# EAGLE design Tarocco-Lite (EAGLE 8.0.0)
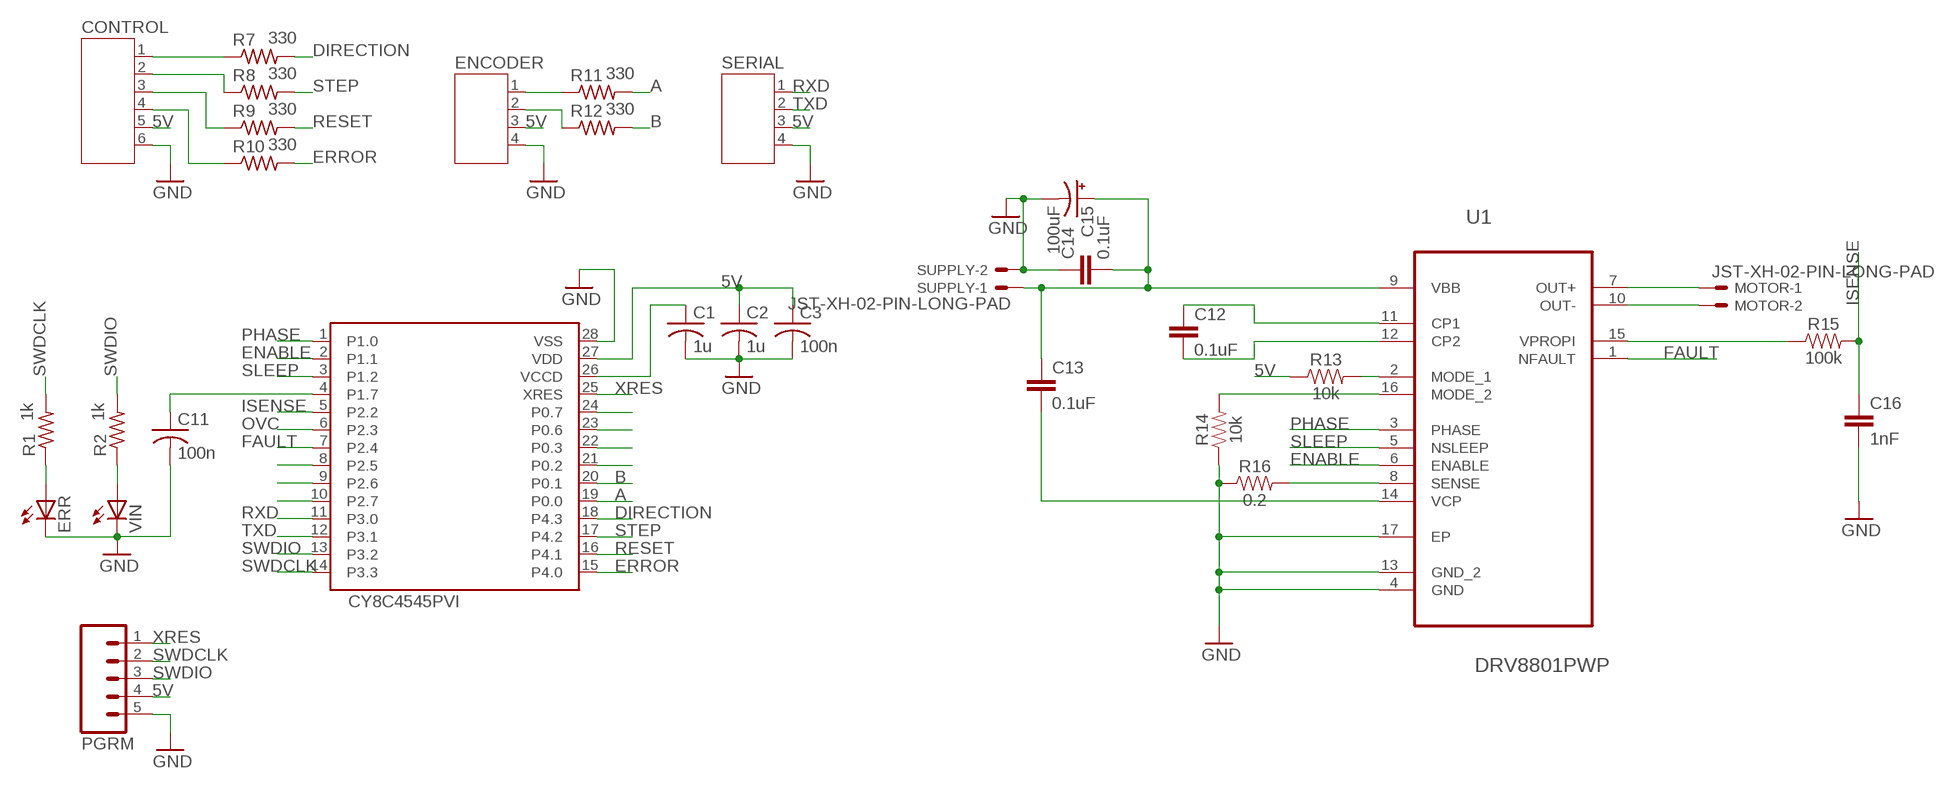
[diagram p0: schematic, sheet 1]

## Parts
C1  1u  C-USC0603  [C0603]
C2  1u  C-USC0603  [C0603]
C3  100n  C-USC0603  [C0603]
C11  100n  C-USC0603  [C0603]
C12  0.1uF  0.1UF-0603-100V-10%  [0603]
C13  0.1uF  0.1UF-0603-25V-(+80/-20%)  [0603]
C14  0.1uF  0.1UF-0603-25V-(+80/-20%)  [0603]
C15  100uF  100UF-POLAR-25V-20%(ELEC)  [PANASONIC_D]
C16  1nF  1.0NF/1000PF-0603-50V-10%  [0603]
CONTROL  JST-PH6  [JST-PH6]
ENCODER  JST-PH4  [JST-PH4]
ERR  LEDCHIP-LED0603  [CHIP-LED0603]
IC1  CY8C4545PVI  [SSOP28]
MOTOR  JST-XH-02-PIN-LONG-PAD  [JST-XH-02-PACKAGE-LONG-PAD]
PGRM  M05SMD2  [1X05-1MM-RA]
R1  1k  R-US_R0603  [R0603]
R2  1k  R-US_R0603  [R0603]
R7  330  R-US_R0603  [R0603]
R8  330  R-US_R0603  [R0603]
R9  330  R-US_R0603  [R0603]
R10  330  R-US_R0603  [R0603]
R11  330  R-US_R0603  [R0603]
R12  330  R-US_R0603  [R0603]
R13  10k  10KOHM-0603-1/10W-1%  [0603]
R14  10k  10KOHM-0603-1/10W-1%  [0603]
R15  100k  100KOHM-0603-1/10W-1%  [0603]
R16  0.2  0.1OHM-1210-1/2W-1%  [1210]
SERIAL  JST-PH4  [JST-PH4]
SUPPLY  JST-XH-02-PIN-LONG-PAD  [JST-XH-02-PACKAGE-LONG-PAD]
U1  DRV8801PWP  [SOP65P640X120-17N]
VIN  LEDCHIP-LED0603  [CHIP-LED0603]

## Nets
5V: C2.1 C3.1 CONTROL.5 ENCODER.3 IC1.27(VDD) PGRM.4 R13.1 SERIAL.3
A: IC1.19(P0.0) R11.2
B: IC1.20(P0.1) R12.2
DIRECTION: IC1.18(P4.3) R7.2
ENABLE: IC1.2(P1.1) U1.6(ENABLE)
ERROR: IC1.15(P4.0) R10.2
FAULT: IC1.7(P2.4) U1.1(NFAULT)
GND: C1.2 C2.2 C3.2 C11.2 C14.1 C15.- C16.2 CONTROL.6 ENCODER.4 ERR.C IC1.28(VSS) PGRM.5 R14.1 R16.1 SERIAL.4 SUPPLY.2 U1.4(GND) U1.13(GND_2) U1.17(EP) VIN.C
ISENSE: C16.1 IC1.5(P2.2) R15.2
N$8: ENCODER.1 R11.1
N$9: R13.2 U1.2(MODE_1)
N$10: ENCODER.2 R12.1
N$14: CONTROL.1 R7.1
N$18: CONTROL.2 R8.1
N$19: C1.1 IC1.26(VCCD)
N$20: CONTROL.3 R9.1
N$22: CONTROL.4 R10.1
N$24: ERR.A R1.1
N$25: R2.1 VIN.A
N$27: R15.1 U1.15(VPROPI)
N$28: C12.1 U1.11(CP1)
N$29: C11.1 IC1.4(P1.7)
N$30: C12.2 U1.12(CP2)
N$31: C13.2 U1.14(VCP)
N$32: R14.2 U1.16(MODE_2)
N$33: IC1.8(P2.5)
N$34: IC1.9(P2.6)
N$35: IC1.10(P2.7)
N$46: IC1.21(P0.2)
N$47: IC1.22(P0.3)
N$48: IC1.23(P0.6)
N$49: IC1.24(P0.7)
OVC: IC1.6(P2.3)
PHASE: IC1.1(P1.0) U1.3(PHASE)
RESET: IC1.16(P4.1) R9.2
RXD: IC1.11(P3.0) SERIAL.1
SENSE: R16.2 U1.8(SENSE)
SLEEP: IC1.3(P1.2) U1.5(NSLEEP)
STEP: IC1.17(P4.2) R8.2
SWDCLK: IC1.14(P3.3) PGRM.2 R1.2
SWDIO: IC1.13(P3.2) PGRM.3 R2.2
TXD: IC1.12(P3.1) SERIAL.2
VBB: C13.1 C14.2 C15.+ SUPPLY.1 U1.9(VBB)
VMOT+: MOTOR.1 U1.7(OUT+)
VMOT-: MOTOR.2 U1.10(OUT-)
XRES: IC1.25(XRES) PGRM.1

## Library data of the parts
C1-C3 C11 = adafruit:C-US: CAPACITOR, American symbol
C12 = SparkFun-Capacitors:0.1UF: 0.1µF ceramic capacitors A capacitor is a passive two-terminal electrical component used to store electrical energy temporarily in an electric field.; PROD_ID: CAP-08390
C13 C14 = SparkFun-Capacitors:0.1UF: 0.1µF ceramic capacitors A capacitor is a passive two-terminal electrical component used to store electrical energy temporarily in an electric field.; PROD_ID: CAP-00810
C15 = SparkFun-Capacitors:100UF-POLAR: 100µF polarized capacitors A capacitor is a passive two-terminal electrical component used to store electrical energy temporarily in an electric field.; PROD_ID: CAP-12547
C16 = SparkFun-Capacitors:1.0NF/1000PF: 1nF/1,000pF ceramic capacitors A capacitor is a passive two-terminal electrical component used to store electrical energy temporarily in an electric field.; PROD_ID: CAP-07886
CONTROL = jst-ph:JST-PH6
ENCODER SERIAL = jst-ph:JST-PH4
ERR VIN = adafruit:LED: LED OSRAM: - CHIPLED LG R971, LG N971, LY N971, LG Q971, LY Q971, LO R971, LY R971 LH N974, LH R974 LS Q976, LO Q976, LY Q976 LO Q996 - Hyper CHIPLED LW Q18S LB Q993, LB Q99A, LB R99A - SideLED LS A670, LO A670, LY A670, LG A670, LP A670 LB A673, LV A673, LT A673, LW A673 LH A674 LY A675 LS A676, LA A676, LO A676, LY A676, LW A676 LS A679, LY A679, LG A679 - Hyper Micro SIDELED® LS Y876, LA Y876, LO Y876, LY Y876 LT Y87S - SmartLED LW L88C, LW L88S LB L89C, LB L89S, LG L890 LS L89K, LO L89K, LY L89K LS L896, LA L896, LO L896, LY L896 - TOPLED LS T670, LO T670, LY T670, LG T670, LP T670 LSG T670, LSP T670, LSY T670, LOP T670, LYG T670 LG T671, LOG T671, LSG T671 LB T673, LV T673, LT T673, LW T673 LH T674 LS T676, LA T676, LO T676, LY T676, LB T676, LH T676, LSB T676, LW T676 LB T67C, LV T67C, LT T67C, LS T67K, LO T67K, LY T67K, LW E67C LS E67B, LA E67B, LO E67B, LY E67B, LB E67C, LV E67C, LT E67C LW T67C LS T679, LY T679, LG T679 LS T770, LO T770, LY T770, LG T770, LP T770 LB T773, LV T773, LT T773, LW T773 LH T774 LS E675, LA E675, LY E675, LS T675 LS T776, LA T776, LO T776, LY T776, LB T776 LHGB T686 LT T68C, LB T68C - Hyper Mini TOPLED® LB M676 - Mini TOPLED Santana® LG M470 LS M47K, LO M47K, LY M47K Source: http://www.osram.convergy.de/
IC1 = CY8C4200:CY8C4545PVI: CY8C4245 SSOP-28
MOTOR SUPPLY = JST XH Connectors v1-0:JST-XH-02-PIN: JST XH Connector 2 Pin Wire to board connector. Pitch: 2,54 mm, (0.100") Number of pins: 2 Created by Rembrandt Electronics www.rembrandtelectronics.com
PGRM = SparkFun-Connectors:M05: Header 5 Standard 5-pin 0.1" header. Use with straight break away headers (SKU : PRT-00116), right angle break away headers (PRT-00553), swiss pins (PRT-00743), machine pins (PRT-00117), and female headers (PRT-00115). Molex polarized connector foot print use with SKU : PRT-08230 with associated crimp pins and housings.
R1 R2 R7-R12 = adafruit:R-US_: RESISTOR, American symbol
R13 R14 = SparkFun-Resistors:10KOHM: 10kΩ resistor A resistor is a passive two-terminal electrical component that implements electrical resistance as a circuit element. Resistors act to reduce current flow, and, at the same time, act to lower voltage levels within circuits. - Wikipedia; PROD_ID: RES-00824
R15 = SparkFun-Resistors:100KOHM: 100kΩ resistor A resistor is a passive two-terminal electrical component that implements electrical resistance as a circuit element. Resistors act to reduce current flow, and, at the same time, act to lower voltage levels within circuits. - Wikipedia; PROD_ID: RES-07828
R16 = SparkFun-Resistors:0.1OHM: 0.1Ω resistor A resistor is a passive two-terminal electrical component that implements electrical resistance as a circuit element. Resistors act to reduce current flow, and, at the same time, act to lower voltage levels within circuits. - Wikipedia; PROD_ID: RES-12374; VALUE: 0.1
U1 = DRV8801PWP:DRV8801PWP: DMOS FULL-BRIDGE MOTOR DRIVERS; AVAILABILITY: Good; DESCRIPTION: 2.8A Brushed DC Motor Driver with Current Sense (PH/EN Ctrl) 16-HTSSOP -40 to 85; MF: Texas Instruments; MP: DRV8801PWP; PACKAGE: HTSSOP-16 Texas Instruments; PRICE: 2.38 USD

## Board
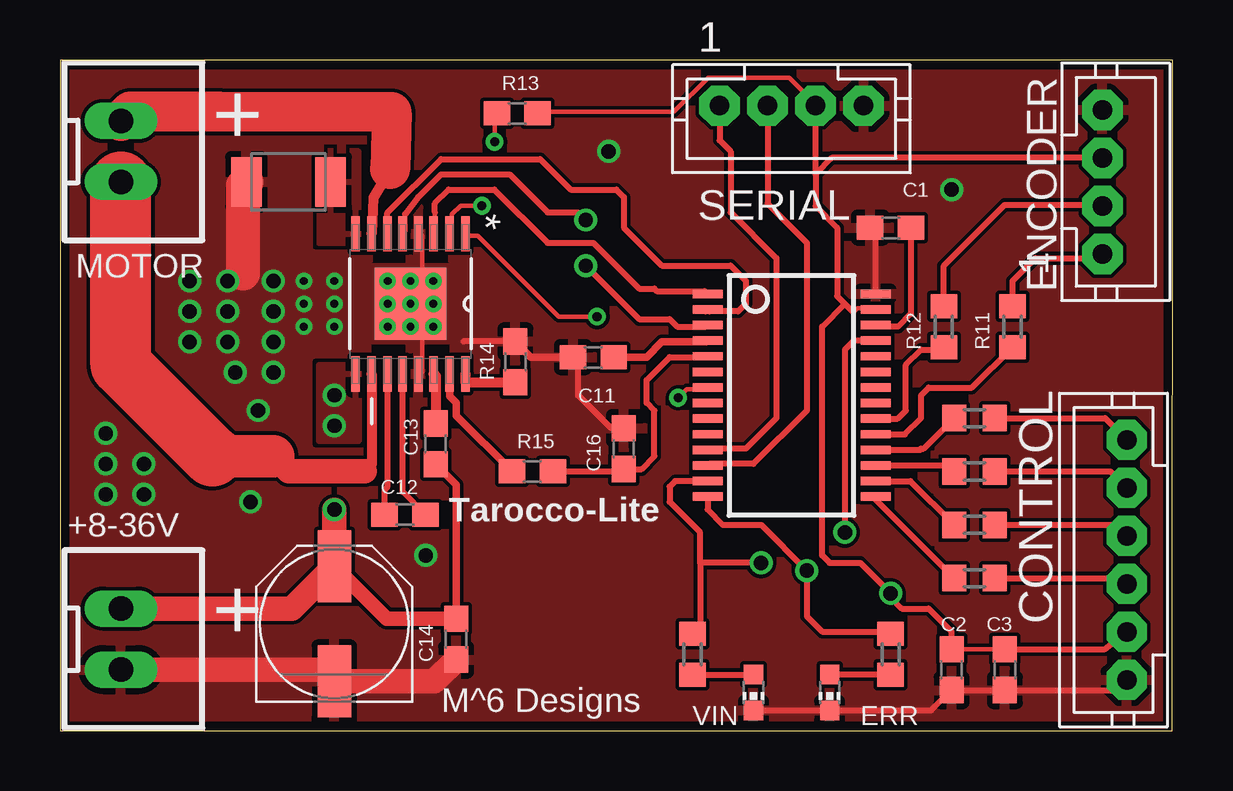
[diagram p1: board, top side]
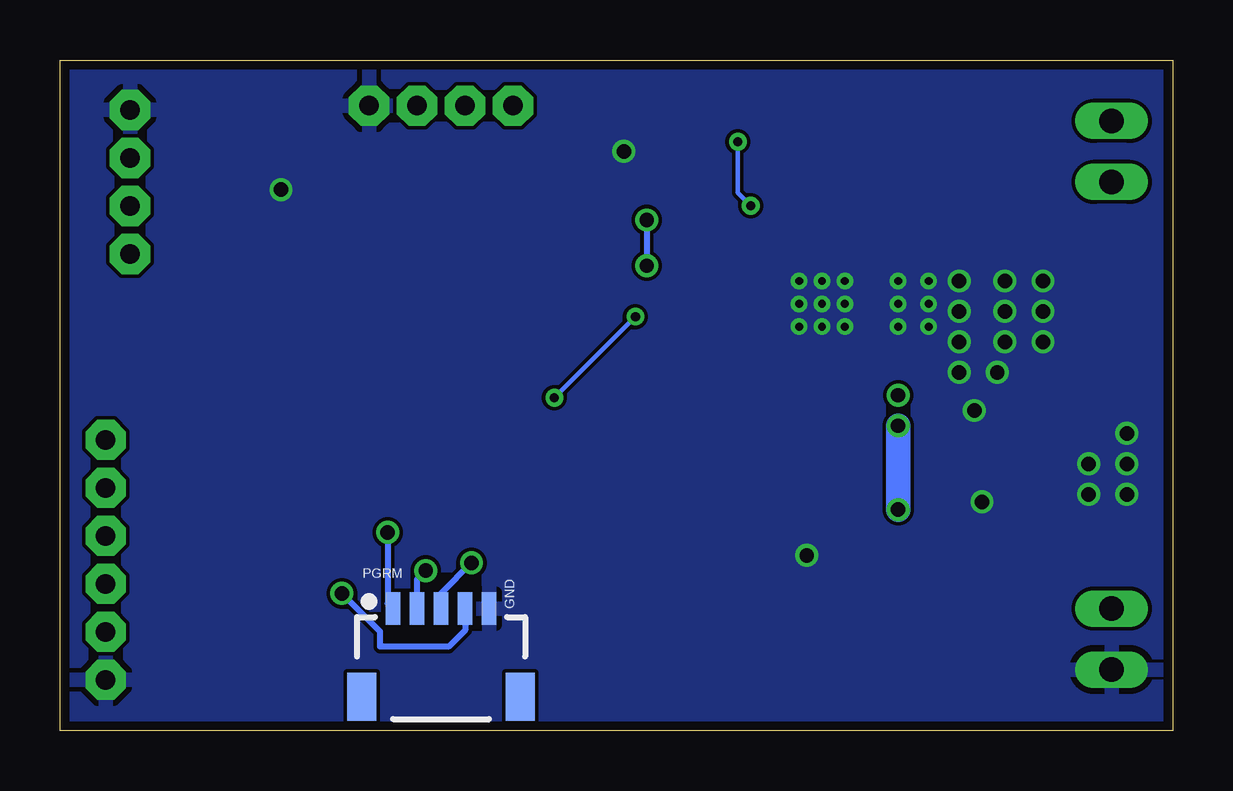
[diagram p2: board, bottom side, seen from below]

Size 46.36 x 27.94 mm. Coordinates in mm from the lower left corner, seen from the top.
Outline: 0,0 46.33,0 46.36,27.94 0,27.94 0,0
Copper layers (1*16): Top 0.0356mm / dielectric 1.5011mm / Bottom 0.0356mm
Design rules "LaenPCBOrder": minimum track width 6mil, minimum drill 13mil, track to track 6mil, track to pad 6mil, pad to pad 6mil, via to via 6mil, smd to smd 6mil, copper to edge 15mil, drill to drill 6mil, minimum pad ring 7mil, minimum via ring 7mil, stop-mask expansion 4mil, vias tented up to drill 0mil, thermal gap 10mil

### Footprints (pad centres in the part's own frame; a part is rotated, then mirrored left to right if it is on the bottom)
C0603 = smd 1.1 x 1: 1 -0.85,0; 2 0.85,0
0603 = smd 1.1 x 1: 1 -0.85,0; 2 0.85,0
PANASONIC_D = smd 3 x 1.4: + 2.4,0; - -2.4,0
JST-PH6 = drill 0.813 pad 1.676 octagon: 1 5,0; 2 3,0; 3 1,0; 4 -1,0; 5 -3,0; 6 -5,0
JST-PH4 = drill 0.813 pad 1.676 octagon: 1 3,0; 2 1,0; 3 -1,0; 4 -3,0
CHIP-LED0603 = smd 0.8 x 0.8: A 0,-0.75; C 0,0.75
SSOP28 = smd 0.35 x 1.25: 1 -4.225,-3.5; 2 -3.575,-3.5; 3 -2.925,-3.5; 4 -2.275,-3.5; 5 -1.625,-3.5; 6 -0.975,-3.5; 7 -0.325,-3.5; 8 0.325,-3.5; 9 0.975,-3.5; 10 1.625,-3.5; 11 2.275,-3.5; 12 2.925,-3.5; 13 3.575,-3.5; 14 4.225,-3.5; 15 4.225,3.5; 16 3.575,3.5; 17 2.925,3.5; 18 2.275,3.5; 19 1.625,3.5; 20 0.975,3.5; 21 0.325,3.5; 22 -0.325,3.5; 23 -0.975,3.5; 24 -1.625,3.5; 25 -2.275,3.5; 26 -2.925,3.5; 27 -3.575,3.5; 28 -4.225,3.5
JST-XH-02-PACKAGE-LONG-PAD = drill 1.016 long: 1 -1.27,0; 2 1.27,0
1X05-1MM-RA = smd 0.6 x 1.35: 1 -2,0; 2 -1,0; 3 0,0; 4 1,0; 5 2,0 | smd 1.2 x 2: NC1 3.3,-3.675; NC2 -3.3,-3.675
R0603 = smd 1 x 1.1: 1 -0.85,0; 2 0.85,0
1210 = smd 1.27 x 2.06: 1 -1.755,0; 2 1.755,0
SOP65P640X120-17N = smd 1.473 x 0.356: 1 -2.921,2.286; 2 -2.921,1.626; 3 -2.921,0.965; 4 -2.921,0.33; 5 -2.921,-0.33; 6 -2.921,-0.965; 7 -2.921,-1.626; 8 -2.921,-2.286; 9 2.921,-2.286; 10 2.921,-1.626; 11 2.921,-0.965; 12 2.921,-0.33; 13 2.921,0.33; 14 2.921,0.965; 15 2.921,1.626; 16 2.921,2.286 | smd 2.997 x 2.997: 17 0,0

### Placement (x,y rotation side)
C1  34.61,20.95 180 top
C2  39.37,2.54 270 top
C3  37.15,2.54 270 top
C11  22.22,15.56 180 top
C12  14.37,9 0 top
C13  15.66,11.95 90 top
C14  16.51,3.81 90 top
C15  11.43,4.45 90 top
C16  23.5,11.75 90 top
CONTROL  44.45,7.11 90 top
ENCODER  43.43,22.86 270 top
ERR  32.07,1.59 180 top
IC1  30.48,13.97 270 top
MOTOR  2.54,24.13 270 top
PGRM  30.48,5.08 0 bottom
R1  34.61,3.17 90 top
R2  26.35,3.17 90 top
R7  38.1,13.02 180 top
R8  38.1,10.79 180 top
R9  38.1,8.57 180 top
R10  38.1,6.35 180 top
R11  39.69,16.83 270 top
R12  36.83,16.83 270 top
R13  19.05,25.72 180 top
R14  18.97,15.36 270 top
R15  19.68,10.79 0 top
R16  9.52,22.86 0 top
SERIAL  30.48,26.04 180 top
SUPPLY  2.54,3.81 270 top
U1  14.61,17.78 270 top
U$1  [OSHW-LOGO-L_COPPER]  21.27,4.76 0 top
VIN  28.89,1.59 180 top

### Tracks (layer width: path | path; a pad name or v marks a point on that pad's centre or on a via)
5V  (via drill 0.6)
  Top 0.178: CONTROL.5 44.42,4.45 | C2.1 39.27,3.38 37.31,3.38 C3.1 37.14,3.38 36.96,3.2 | R13.1 20.07,25.78 25.58,25.78 27,27.2 30.38,27.2 31.44,26.14 SERIAL.3 | IC1.27 33.93,17.6 33.22,17.6 33.05,17.43
  Top 0.254: 44.31,4.45 CONTROL.5 43.54,3.39 C2.1 | 31.48,23.18 SERIAL.3 | 31.48,23.18 31.48,21.86 32.39,20.95 32.39,18.1 32.7,17.78 | 32.7,17.78 33.05,17.43 | ENCODER.3 32.16,23.86 31.48,23.18 | C3.1 37.15,4.13 36.19,5.08 35.08,5.08 34.61,5.55 v34.61,5.71 33.34,6.99 32.07,6.99 31.75,7.3 31.75,16.83 32.7,17.78
  Bottom 0.178: 29.49,4.98 PGRM.4
  Bottom 0.254: PGRM.4 29.48,4.17 30.16,3.49 33.02,3.49 33.02,4.13 v34.61,5.71
A
  Top 0.254: IC1.19 35.2,12.35 35.88,13.02 35.88,13.97 36.19,14.29 38,14.29 R11.2
B
  Top 0.254: IC1.20 34.9,12.99 35.24,13.34 35.24,15.24 35.88,15.88 36.73,15.88 R12.2
DIRECTION
  Top 0.254: IC1.18 35.83,11.7 35.88,11.75 35.98,11.75 R7.2
ENABLE
  Top 0.254: U1.6 13.64,21.58 15.88,23.81 20,23.81 21.27,22.54 23.18,22.54 23.5,22.23 23.5,20.95 25.08,19.37 27.94,19.37 28.57,18.73 28.57,17.78 28.26,17.46 27.06,17.46 IC1.2 26.9,17.46
ERROR
  Top 0.254: IC1.15 33.98,9.62 R10.2
FAULT  (via drill 0.38)
  Top 0.178: v25.76,13.87 26.11,14.22 26.82,14.22 IC1.7 | v22.38,17.25 20.78,17.25 17.4,20.62 17.04,20.62 U1.1
  Bottom 0.178: v22.38,17.25 v25.76,13.87
GND  (via drill 0.33, 0.6)
  Top 0.178: U1.13 15.09,14.94 15.09,16.36 15.24,16.51 | U1.4 15.09,20.62 15.09,19.2 15.24,19.05 | 15.24,17.78 U1.17 | 34.11,18.14 IC1.28 33.93,18.31
  Top 0.254: C16.2 22.96,12.6 21.59,13.97 21.59,15.34 C11.2 | CONTROL.6 43.84,1.69 C2.2 C3.2 36.3,0.84 ERR.C VIN.C | IC1.28 33.98,20.73 C1.2 | R14.1 16.81,16.21
  Top 0.305: R14.1 19.62,15.56 C11.2
  Top 0.406: 19.05,16.29 R14.1
  Top 1.016: SUPPLY.2 10.93,2.54 C15.- 15.59,2.04 C14.1
  Top 1.422: R16.1 7.62,22.71 7.62,19.05
  other vias: 5.4,18.73 5.4,16.19 8.25,13.34 8.89,16.19 8.89,14.92 7.3,14.92 6.98,16.19 5.4,17.46 6.98,17.46 8.89,17.46 8.89,18.73 6.98,18.73 14.61,17.78 13.65,18.73 11.43,18.73 11.43,16.83 11.43,17.78 14.61,18.73 13.65,17.78 15.56,18.73 15.56,17.78 15.56,16.83 14.61,16.83 13.65,16.83 10.16,18.73 10.16,17.78 10.16,16.83 37.15,22.54 1.9,12.38 1.9,11.11 1.9,9.84 3.49,9.84 3.49,11.11 7.94,9.53 22.86,24.13 15.24,7.3
  pour Bottom (isolate 0.025): 0,27.94 46.99,27.94 46.99,0 0,0
  pour Top (no thermals): 17.78,19.37 17.78,16.19 9.84,16.19 9.84,12.7 7.94,12.7 4.76,15.88 4.76,19.37
  pour Top (rank 6): 0,27.94 0,0 46.36,0 46.36,0.32 46.36,27.94
ISENSE
  Top 0.254: R15.2 23.39,10.79 C16.1 24.23,10.9 24.76,11.43 24.76,13.34 24.45,13.65 24.45,14.61 25.4,15.56 26.94,15.56 IC1.5
N$8
  Top 0.254: R11.1 39.69,18.73 40.64,19.68 43.26,19.68 ENCODER.1
N$9  (via drill 0.38)
  Top 0.178: v18.11,24.54 18.11,25.6 R13.2 | v17.58,21.87 16.69,21.87 16.33,21.51 16.33,20.8 U1.2
  Bottom 0.178: v18.11,24.54 18.11,22.4 v17.58,21.87
N$10
  Top 0.254: R12.1 36.83,19.37 39.37,21.91 43.39,21.91 ENCODER.2
N$14
  Top 0.254: R7.1 43.55,13.02 CONTROL.1
N$18
  Top 0.254: R8.1 43.77,10.79 CONTROL.2
N$19
  Top 0.254: C1.1 35.46,17.36 34.92,16.83 34.05,16.83 IC1.26
N$20
  Top 0.254: R9.1 43.99,8.57 CONTROL.3
N$22
  Top 0.254: R10.1 44.21,6.35 CONTROL.4
N$24
  Top 0.254: ERR.A 34.59,2.34 R1.1
N$25
  Top 0.254: R2.1 28.88,2.33 VIN.A
N$27
  Top 0.305: U1.15 16.23,13.93 16.51,13.65 16.51,13.12 R15.1
N$28
  Top 0.254: C12.1 13.52,10.03 13.65,10.16 13.65,14.85 U1.11
N$29
  Top 0.305: C11.1 24.45,15.56 25.08,16.19 26.93,16.19 IC1.4
N$30
  Top 0.254: C12.2 14.27,9.95 U1.12
N$31
  Top 0.406: U1.14 15.66,14.77 C13.2
N$32
  Top 0.406: U1.16 16.89,14.51 R14.2
PHASE
  Top 0.178: 15.62,21.87 15.62,21.59 15.62,20.8 U1.3 | IC1.1 26.82,18.31
  Top 0.254: 15.62,21.59 15.62,21.97 16.19,22.54 18.1,22.54 20.32,20.32 22.22,20.32 24.13,18.41 24.76,18.41 24.87,18.31 26.86,18.31 IC1.1
RESET
  Top 0.254: IC1.16 35.43,10.39 R9.2
RXD
  Top 0.254: SERIAL.1 27.48,24.59 27.94,24.13 27.94,21.59 29.85,19.68 29.85,13.02 28.57,11.75 27.03,11.75 IC1.11
SENSE
  pour Top: 12.45,20.32 12.45,24.13 10.79,24.13 10.79,20.32
SLEEP  (via drill 0.6)
  Top 0.178: 14.38,21.51 14.38,20.8 U1.5
  Top 0.254: 14.38,21.51 14.92,22.23 15.88,23.18 18.73,23.18 20.32,21.59 21.59,21.59 v21.91,21.27 | v21.91,19.37 24.13,17.14 25.4,17.14 25.72,16.83 26.91,16.83 IC1.3
  Bottom 0.254: v21.91,21.27 v21.91,19.37
STEP
  Top 0.254: IC1.17 37,11.04 R8.2
SWDCLK  (via drill 0.6)
  Top 0.254: R1.2 34.5,4.13 31.75,4.13 31.11,4.76 v31.11,6.67 29.21,8.57 27.62,8.57 26.98,9.21 IC1.14
  Bottom 0.254: PGRM.2 31.48,6.3 v31.11,6.67
SWDIO  (via drill 0.6)
  Top 0.254: IC1.13 25.64,10.39 25.4,10.16 25.4,9.53 26.67,8.26 26.67,6.99 | 26.67,4.34 R2.2 26.67,4.34 | 26.67,6.99 26.67,4.34 | v29.21,6.99 26.67,6.99
  Bottom 0.254: PGRM.3 30.48,5.71 v29.21,6.99
TXD
  Top 0.254: SERIAL.2 29.48,21.95 31.11,20.32 31.11,13.34 28.89,11.11 27.05,11.11 IC1.12
VBB  (via drill 0.6)
  Top 0.305: C13.1 16.51,10.24 C14.2
  Top 0.61: C15.+ 13.61,4.66 C14.2
  Top 1.016: v11.43,9.21 C15.+ 9.66,5.08 SUPPLY.1
  Bottom 1.016: v11.43,12.7 v11.43,9.21
  other vias: 11.43,13.97
  pour Top (isolate 0.025): 12.45,15.24 12.45,12.06 10.79,12.06 10.79,15.24
VMOT+
  Top 0.406: 13.75,23.39 13.06,22.21 U1.7
  Top 1.676: 13.75,23.39 13.82,25.77 6.63,25.79 2.93,25.79 MOTOR.1
VMOT-
  Top 0.406: U1.10 12.98,11.07 12.7,10.79
  Top 1.016: 12.7,10.79 9.52,10.79 8.89,11.43
  Top 1.778: 8.89,11.43 6.35,11.43
  Top 2.54: 6.35,11.43 2.54,15.24 MOTOR.2
XRES  (via drill 0.6)
  Top 0.254: IC1.25 33.07,16.25 32.7,15.88 v32.7,8.26
  Bottom 0.254: v32.7,8.26 32.7,5.3 PGRM.1

### Text on the board
tNames: R13 | + | C1 | MOTOR | R12 | R11 | R14 | C11 | C13 | R15 | C16 | C12 | +8-36V | Tarocco-Lite | + | C2 | C3 | CONTROL | C14 | M^6 Designs | VIN | ERR
bNames: GND